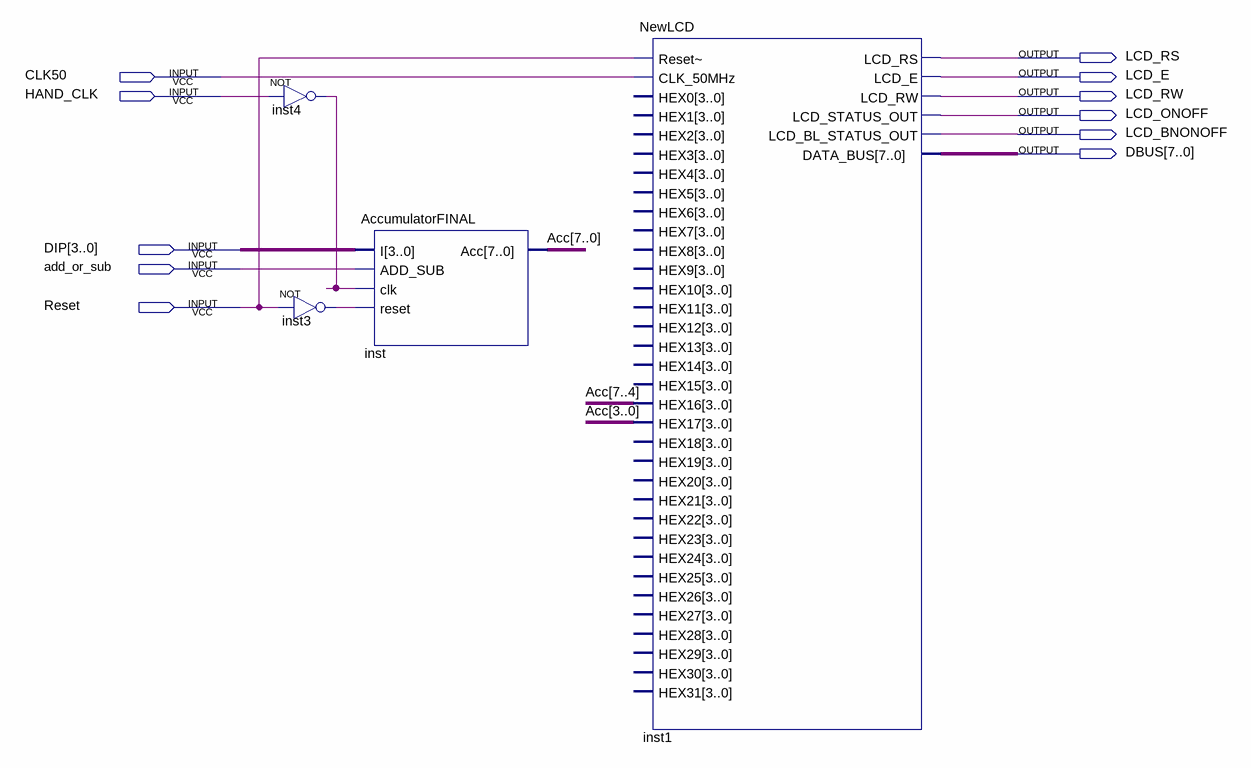
[diagram p0: schematic sheet]
// Quartus schematic AccumulatorLCD.bdf as structural Verilog: 4 symbols, 11 pins
module AccumulatorLCD (
  input  CLK50,
  input  HAND_CLK,
  input  [3:0] DIP,
  input  add_or_sub,
  input  Reset,
  output LCD_RS,
  output LCD_E,
  output LCD_RW,
  output LCD_ONOFF,
  output LCD_BNONOFF,
  output [7:0] DBUS
);

  wire inst3_out, inst4_out;
  wire [7:0] Acc;

  not inst4 (inst4_out, HAND_CLK);
  not inst3 (inst3_out, Reset);
  AccumulatorFINAL inst (.I(DIP), .ADD_SUB(add_or_sub), .clk(inst4_out), .reset(inst3_out), .Acc(Acc));
  NewLCD inst1 (
    .\Reset~ (Reset), .CLK_50MHz(CLK50), .HEX16(Acc[7:4]), .HEX17(Acc[3:0]), .LCD_RS(LCD_RS), .LCD_E(LCD_E),
    .LCD_RW(LCD_RW), .LCD_STATUS_OUT(LCD_ONOFF), .LCD_BL_STATUS_OUT(LCD_BNONOFF), .DATA_BUS(DBUS));  // open: HEX0, HEX1, HEX2, HEX3, HEX4, HEX5, HEX6, HEX7, HEX8, HEX9, HEX10, HEX11, HEX12, HEX13, HEX14, HEX15, HEX18, HEX19, HEX20, HEX21, HEX22, HEX23, HEX24, HEX25, HEX26, HEX27, HEX28, HEX29, HEX30, HEX31
endmodule
